# EAGLE design 8x8 LED Anode Driver V3 (EAGLE 6.1)
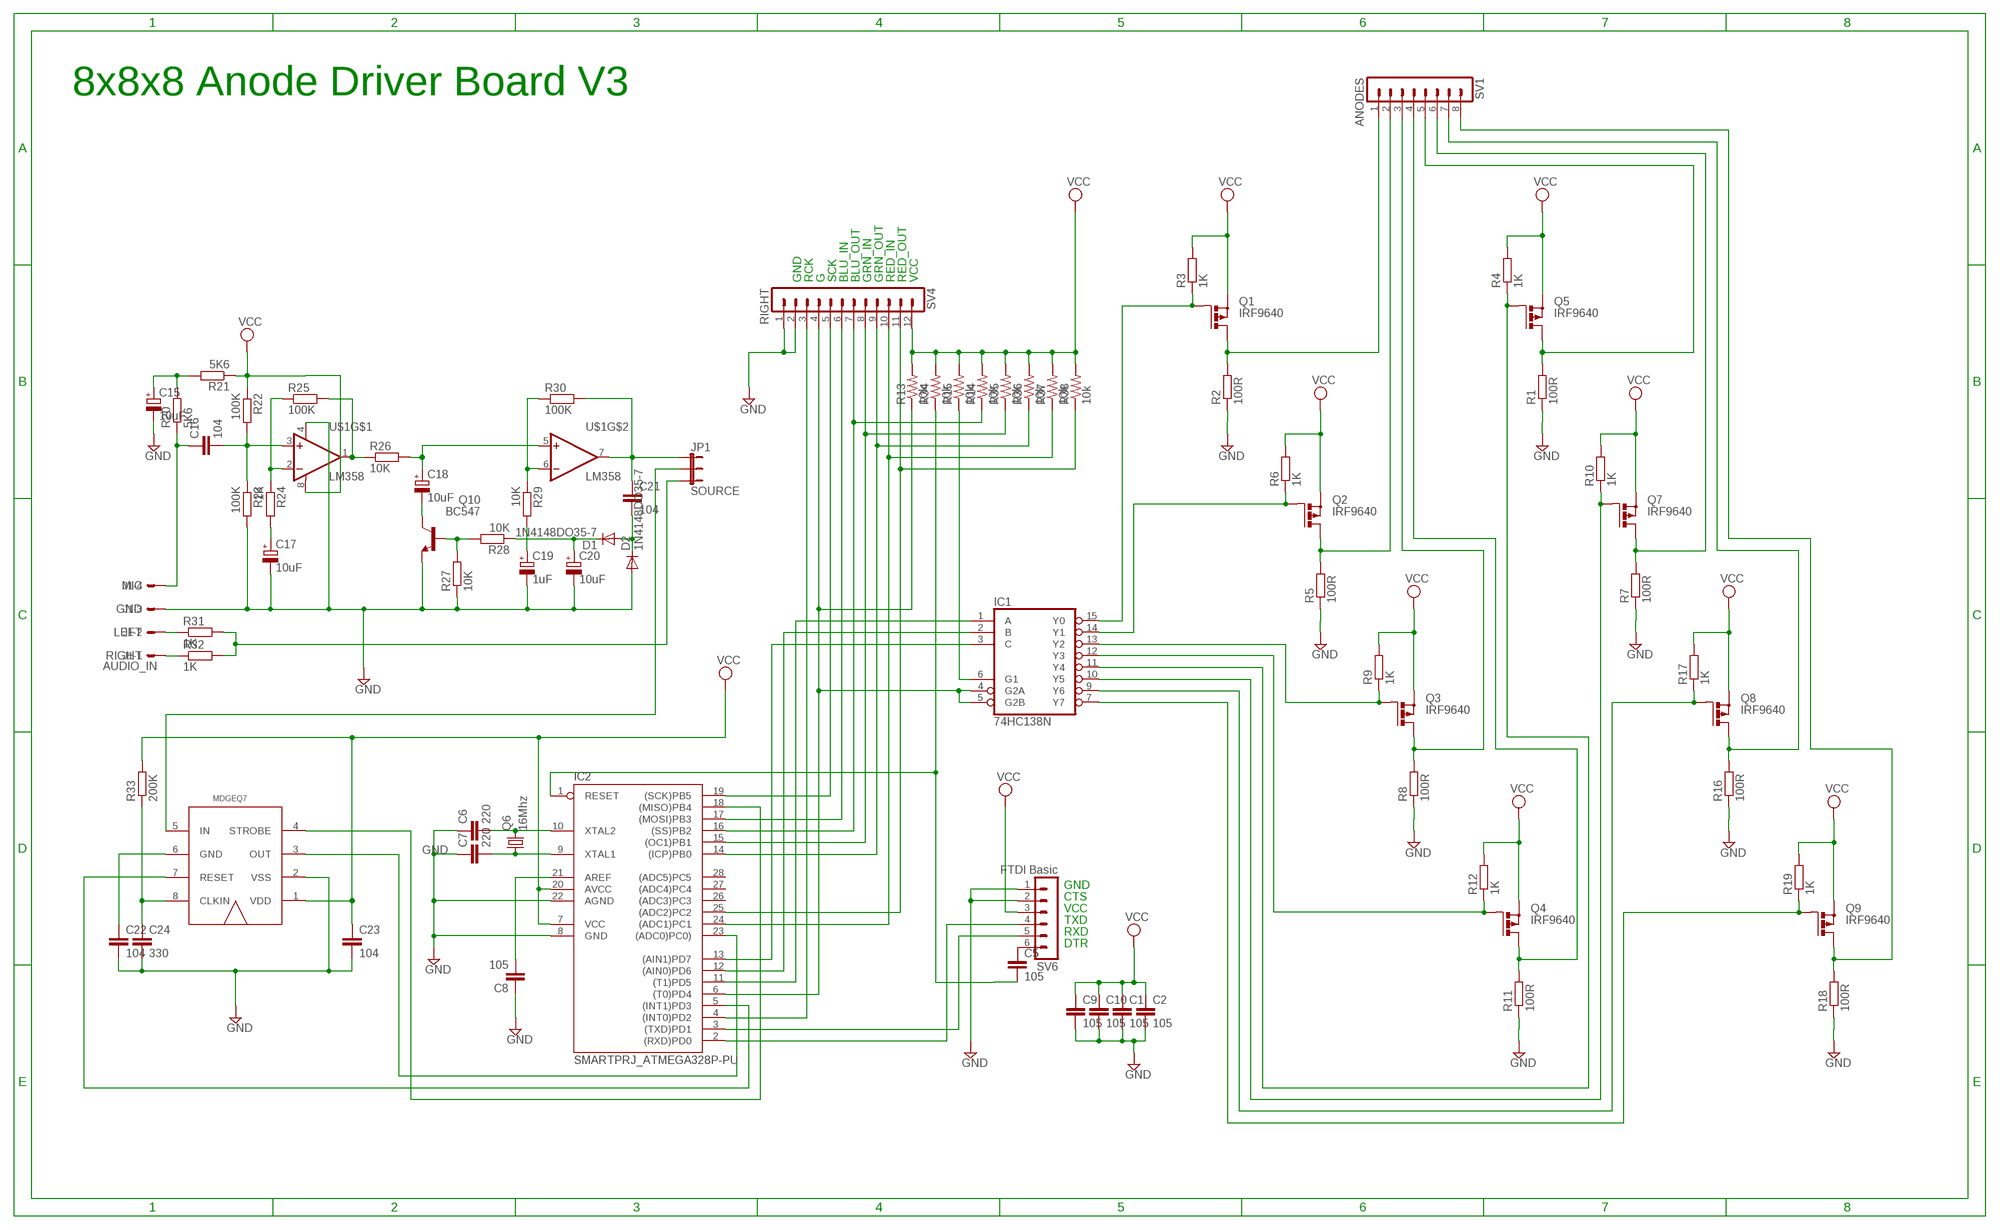
[diagram p0: schematic, sheet 1]

## Parts
C1  105  C-EU025-030X050  [C025-030X050]
C2  105  C-EU025-030X050  [C025-030X050]
C5  105  C-EU050-025X075  [C050-025X075]
C6  220  C-EU050-025X075  [C050-025X075]
C7  220  C-EU050-025X075  [C050-025X075]
C8  105  C-EU025-025X050  [C025-025X050]
C9  105  C-EU025-025X050  [C025-025X050]
C10  105  C-EU025-030X050  [C025-030X050]
C15  10uF  CPOL-EUE2.5-5  [E2,5-5]
C16  104  C-EU050-030X075  [C050-030X075]
C17  10uF  CPOL-EUE2.5-5  [E2,5-5]
C18  10uF  CPOL-EUE2.5-5  [E2,5-5]
C19  1uF  CPOL-EUE2.5-5  [E2,5-5]
C20  10uF  CPOL-EUE2.5-5  [E2,5-5]
C21  104  C-EU050-030X075  [C050-030X075]
C22  104  C-EU025-030X050  [C025-030X050]
C23  104  C-EU025-030X050  [C025-030X050]
C24  330  C-EU050-030X075  [C050-030X075]
D1  1N4148DO35-7  [DO35-7]
D2  1N4148DO35-7  [DO35-7]
IC1  74HC138N  [DIL16]
IC2  SMARTPRJ_ATMEGA328P-PU  [SMARTPRJ_DIL28-3]
J1  AUDIO_IN  22-05-7048-04  [7395-04]
JP1  SOURCE  JUMPER-3PTH  [1X03]
Q1  IRF9640  PMOSFET_PTO220BH_NH  [TO220BH_NO_HOLE]
Q2  IRF9640  PMOSFET_PTO220BH_NH  [TO220BH_NO_HOLE]
Q3  IRF9640  PMOSFET_PTO220BH_NH  [TO220BH_NO_HOLE]
Q4  IRF9640  PMOSFET_PTO220BH_NH  [TO220BH_NO_HOLE]
Q5  IRF9640  PMOSFET_PTO220BH_NH  [TO220BH_NO_HOLE]
Q6  16Mhz  CRYSTALHC49S  [HC49/S]
Q7  IRF9640  PMOSFET_PTO220BH_NH  [TO220BH_NO_HOLE]
Q8  IRF9640  PMOSFET_PTO220BH_NH  [TO220BH_NO_HOLE]
Q9  IRF9640  PMOSFET_PTO220BH_NH  [TO220BH_NO_HOLE]
Q10  BC547  [TO92]
R1  100R  R-EU_0207/10  [0207/10]
R2  100R  R-EU_0207/10  [0207/10]
R3  1K  R-EU_0207/10  [0207/10]
R4  1K  R-EU_0207/10  [0207/10]
R5  100R  R-EU_0207/10  [0207/10]
R6  1K  R-EU_0207/10  [0207/10]
R7  100R  R-EU_0207/10  [0207/10]
R8  100R  R-EU_0207/10  [0207/10]
R9  1K  R-EU_0207/10  [0207/10]
R10  1K  R-EU_0207/10  [0207/10]
R11  100R  R-EU_0207/10  [0207/10]
R12  1K  R-EU_0207/10  [0207/10]
R13  10k  R-US_0207/10  [0207/10]
R14  10k  R-US_0207/10  [0207/10]
R15  10k  R-US_0207/10  [0207/10]
R16  100R  R-EU_0207/10  [0207/10]
R17  1K  R-EU_0207/10  [0207/10]
R18  100R  R-EU_0207/10  [0207/10]
R19  1K  R-EU_0207/10  [0207/10]
R20  5K6  R-EU_0207/10  [0207/10]
R21  5K6  R-EU_0207/10  [0207/10]
R22  100K  R-EU_0207/10  [0207/10]
R23  100K  R-EU_0207/10  [0207/10]
R24  1K  R-EU_0207/10  [0207/10]
R25  100K  R-EU_0207/10  [0207/10]
R26  10K  R-EU_0207/10  [0207/10]
R27  10K  R-EU_0207/10  [0207/10]
R28  10K  R-EU_0207/10  [0207/10]
R29  10K  R-EU_0207/10  [0207/10]
R30  100K  R-EU_0207/10  [0207/10]
R31  1K  R-EU_0207/10  [0207/10]
R32  1K  R-EU_0207/10  [0207/10]
R33  200K  R-EU_0207/10  [0207/10]
R34  10k  R-US_0207/10  [0207/10]
R35  10k  R-US_0207/10  [0207/10]
R36  10k  R-US_0207/10  [0207/10]
R37  10k  R-US_0207/10  [0207/10]
R38  10k  R-US_0207/10  [0207/10]
SV1  ANODES  MA08-1W  [MA08-1W]
SV4  RIGHT  MA12-1W  [MA12-1W]
SV6  FTDI Basic  MA06-1  [MA06-1]
U$1  LM358  [DIP08]
U$2  MSGEQ7  [DIL08]

## Nets
BLANK: IC1.4(G2A) IC1.5(G2B) IC2.6((T0)PD4) R13.1 SV4.4
DRAIN_0: Q1.D R2.2 SV1.1
DRAIN_1: Q2.D R5.2 SV1.2
DRAIN_2: Q3.D R8.2 SV1.3
DRAIN_3: Q4.D R11.2 SV1.4
DRAIN_4: Q5.D R1.2 SV1.5
DRAIN_5: Q7.D R7.2 SV1.6
DRAIN_6: Q8.D R16.2 SV1.7
DRAIN_7: Q9.D R18.2 SV1.8
GND: C1.2 C2.2 C6.1 C7.1 C8.1 C9.2 C10.2 C15.- C17.- C19.- C20.- C22.2 C23.2 C24.2 D2.A IC2.8(GND) IC2.22(AGND) J1.3 Q10.1(E) R1.1 R2.1 R5.1 R7.1 R8.1 R11.1 R16.1 R18.1 R23.2 R27.1 SV4.1 SV4.2 SV6.1 SV6.2 U$1.4(V-) U$2.2(VSS)
LATCH: IC2.4((INT0)PD2) SV4.3
MSGEQ7_OUT: IC2.23((ADC0)PC0)) U$2.3(OUT)
MSGEQ7_RESET: IC2.5((INT1)PD3) U$2.7(RESET)
MSGEQ7_STROBE: IC2.18((MISO)PB4) U$2.4(STROBE)
N$1: IC2.16((SS)PB2) R14.1 SV4.7
N$2: IC1.11(Y4) Q5.G R4.1
N$3: IC1.15(Y0) Q1.G R3.1
N$4: IC1.10(Y5) Q7.G R10.1
N$5: IC1.2(B) IC2.12((AIN0)PD6)
N$6: IC1.14(Y1) Q2.G R6.1
N$7: C15.+ R20.2 R21.2
N$8: IC1.3(C) IC2.13((AIN1)PD7)
N$9: IC1.13(Y2) Q3.G R9.1
N$10: IC1.9(Y6) Q8.G R17.1
N$11: IC1.7(Y7) Q9.G R19.1
N$12: IC1.12(Y3) Q4.G R12.1
N$13: C16.1 J1.4 R20.1
N$14: C16.2 R22.2 R23.1 U$1.3(+IN)
N$15: R24.1 R25.1 U$1.2(-IN)
N$16: C17.+ R24.2
N$17: J1.2 R31.1
N$18: J1.1 R32.1
N$19: JP1.3 R31.2 R32.2
N$20: R25.2 R26.1 U$1.1(OUT)
N$21: C18.+ R26.2 U$1.5(+IN)
N$22: R29.1 R30.1 U$1.6(-IN)
N$23: Q10.2(B) R27.2 R28.2
N$24: C18.- Q10.3(C)
N$25: C19.+ R29.2
N$26: IC2.2((RXD)PD0) SV6.4
N$27: IC2.3((TXD)PD1) SV6.5
N$28: IC2.19((SCK)PB5) SV4.5
N$29: C20.+ D1.C R28.1
N$30: IC2.15((OC1)PB1) R35.1 SV4.8
N$31: C7.2 IC2.9(XTAL1) Q6.1
N$32: C6.2 IC2.10(XTAL2) Q6.2
N$33: C8.2 IC2.21(AREF)
N$34: C5.2 IC2.1(RESET) R34.1
N$35: IC2.17((MOSI)PB3) SV4.6
N$36: C5.1 SV6.6
N$37: IC1.1(A) IC2.11((T1)PD5)
N$38: IC1.6(G1) R15.1
N$39: C21.2 D1.A D2.C
N$40: C21.1 JP1.1 R30.2 U$1.7(OUT)
N$41: JP1.2 U$2.5(IN)
N$42: C22.1 U$2.6(GND)
N$43: C24.1 R33.1 U$2.8(CLKIN)
N$44: IC2.14((ICP)PB0) R36.1 SV4.9
N$45: IC2.24((ADC1)PC1) R37.1 SV4.10
N$46: IC2.25((ADC2)PC2) R38.1 SV4.11
VCC: C1.1 C2.1 C9.1 C10.1 C23.1 IC2.7(VCC) IC2.20(AVCC) Q1.S Q2.S Q3.S Q4.S Q5.S Q7.S Q8.S Q9.S R3.2 R4.2 R6.2 R9.2 R10.2 R12.2 R13.2 R14.2 R15.2 R17.2 R19.2 R21.1 R22.1 R33.2 R34.2 R35.2 R36.2 R37.2 R38.2 SV4.12 SV6.3 U$1.8(V+) U$2.1(VDD)
Unconnected: IC2.26((ADC3)PC3) IC2.27((ADC4)PC4) IC2.28((ADC5)PC5)

## Notes on the sheet
- 8x8x8 Anode Driver Board V3
- GND | RCK | G | SCK | BLU_IN | BLU_OUT | GRN_IN | GRN_OUT | RED_IN | RED_OUT | VCC
- MIC
- GND
- LEFT
- RIGHT
- GND
- CTS
- VCC
- TXD
- RXD
- DTR

## Power pins joined to a net without a drawn wire
GND: IC1.8(GND)
VCC: IC1.16(VCC)

## Library data of the parts
C1 C2 C5-C10 C16 C21-C24 = resistor:C-EU: CAPACITOR, European symbol
C15 C17-C20 = resistor:CPOL-EU: POLARIZED CAPACITOR, European symbol
D1 D2 = diode:1N4148: DIODE high speed (Philips)
IC1 = 74xx-eu:74*138: 3-line to 8-line DECODER/DEMULTIPLEXER
IC2 = arduino_Uno_Rev3-02-TH:SMARTPRJ_ATMEGA328P-: MICROCONTROLLER 4 Kbytes FLASH 128 bytes SRAM 256 bytes EEPROM UART 6-channel 10 bit ADC
J1 = con-molex:22-?-04: CONNECTOR wire to board 2.54 mm (.1 inch) pitch header; OC_FARNELL: unknown; OC_NEWARK: unknown
JP1 = SparkFun-Passives:JUMPER-3
Q1-Q5 Q7-Q9 = transistor-power:PMOSFET_P: Power MOSFET P-Channel
Q6 = crystal:CRYSTAL: CRYSTAL; OC_FARNELL: 1667008; OC_NEWARK: unknown
Q10 = transistor-npn:BC547*: NPN Transistor
R1-R12 R16-R33 = resistor:R-EU_: RESISTOR, European symbol
R13-R15 R34-R38 = resistor:R-US_: RESISTOR, American symbol
SV1 = con-lstb:MA08-1W: PIN HEADER; OC_FARNELL: unknown; OC_NEWARK: unknown
SV4 = con-lstb:MA12-1W: PIN HEADER; OC_FARNELL: unknown; OC_NEWARK: unknown
SV6 = con-lstb:MA06-1: PIN HEADER; OC_FARNELL: unknown; OC_NEWARK: unknown
U$1 = SparkFun-AnalogIC:LM358: Jellybean op-amp
U$2 = 8x8x8_cube:MSGEQ7: Seven Band Graphic Equalizer

## Board
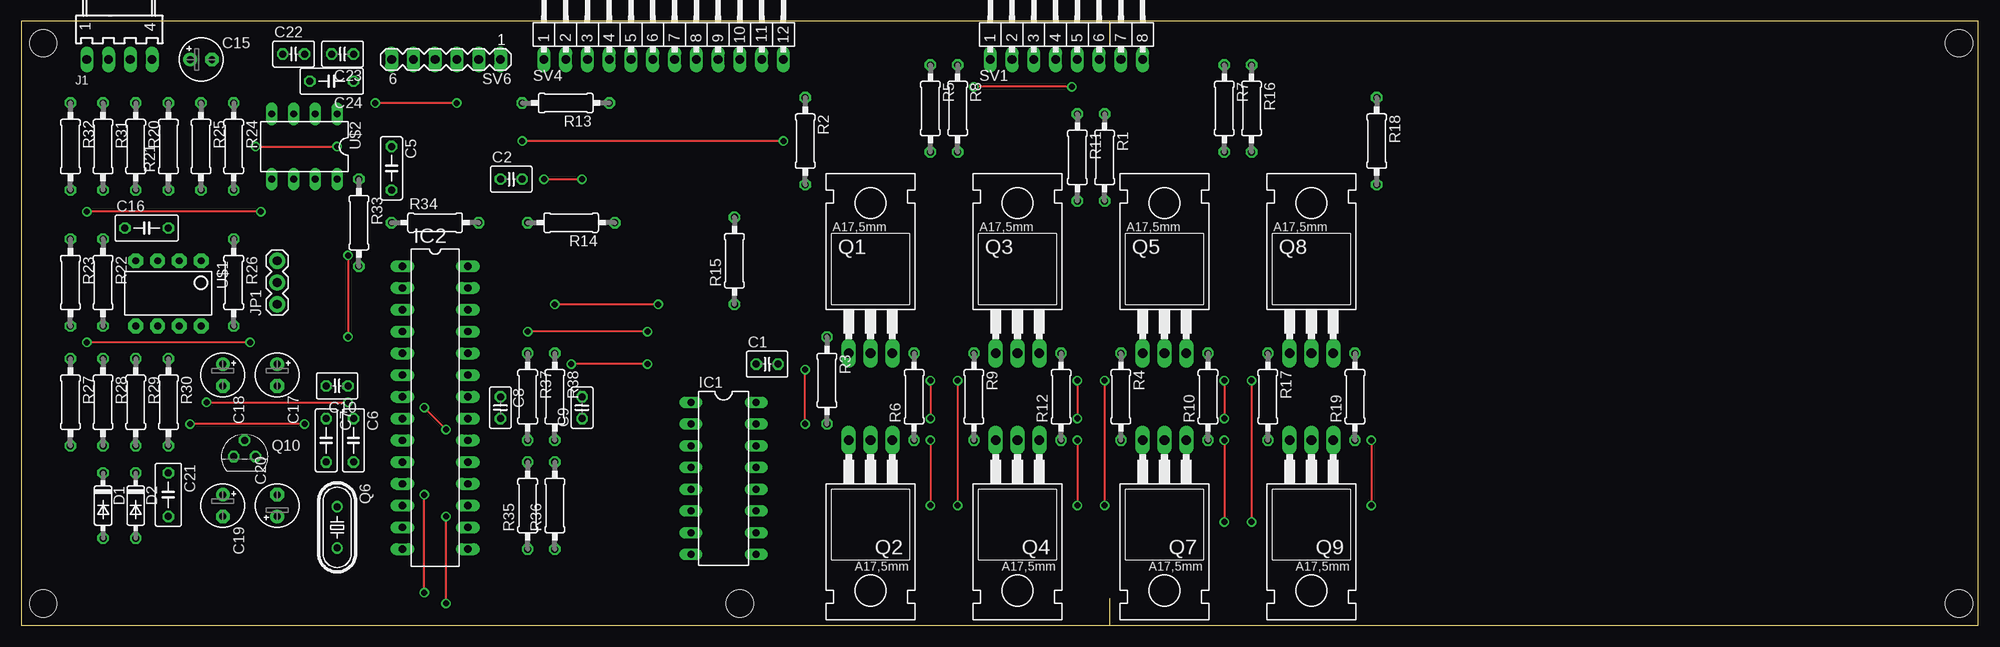
[diagram p1: board, top side]
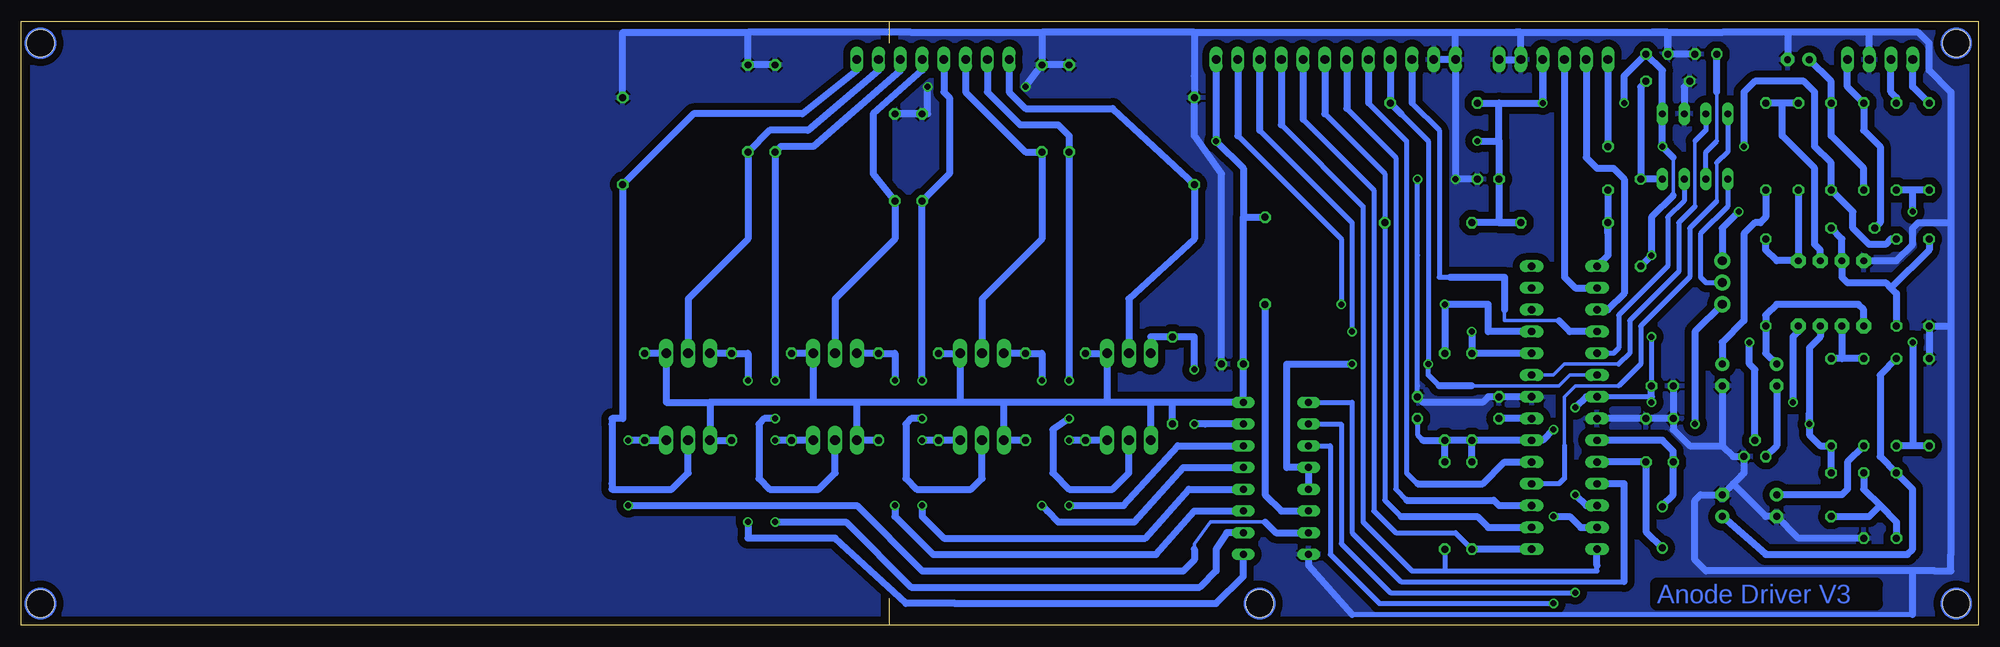
[diagram p2: board, bottom side, seen from below]

Size 228.27 x 70.48 mm. Coordinates in mm from the lower left corner, seen from the top.
Outline: 127,70.48 228.27,70.48 228.27,0.02 0,0.02 0,70.48 127,70.48
Outline: 127,67.94 127,70.48
Outline: 127,0 127,3.17
Copper layers (1*16): Top 0.035mm / dielectric 1.5mm / Bottom 0.035mm
Design rules: minimum track width 10mil, minimum drill 24mil, track to track 8mil, track to pad 8mil, pad to pad 8mil, via to via 8mil, smd to smd 8mil, copper to edge 40mil, drill to drill 8mil, minimum pad ring 10mil, minimum via ring 8mil, stop-mask expansion 4mil, vias tented up to drill 0mil, thermal gap 10mil
Holes 3.2 mm at 2.54,2.54 226.06,2.54 226.06,67.94 2.54,67.94 83.82,2.54

### Footprints (pad centres in the part's own frame; a part is rotated, then mirrored left to right if it is on the bottom)
C025-030X050 = drill 0.813 octagon: 1 -1.27,0; 2 1.27,0
C050-025X075 = drill 0.813 octagon: 1 -2.54,0; 2 2.54,0
C025-025X050 = drill 0.813 octagon: 1 -1.27,0; 2 1.27,0
E2,5-5 = drill 0.813 pad 1.6: + -1.27,0 | drill 0.813 pad 1.6 octagon: - 1.27,0
C050-030X075 = drill 0.813 octagon: 1 -2.54,0; 2 2.54,0
DO35-7 = drill 0.813 octagon: A 3.81,0; C -3.81,0
DIL16 = drill 0.813 long: 1 -8.89,-3.81; 2 -6.35,-3.81; 3 -3.81,-3.81; 4 -1.27,-3.81; 5 1.27,-3.81; 6 3.81,-3.81; 7 6.35,-3.81; 8 8.89,-3.81; 9 8.89,3.81; 10 6.35,3.81; 11 3.81,3.81; 12 1.27,3.81; 13 -1.27,3.81; 14 -3.81,3.81; 15 -6.35,3.81; 16 -8.89,3.81
SMARTPRJ_DIL28-3 = drill 0.85 pad 1.422 long: 1 -16.51,-3.81; 2 -13.97,-3.81; 3 -11.43,-3.81; 4 -8.89,-3.81; 5 -6.35,-3.81; 6 -3.81,-3.81; 7 -1.27,-3.81; 8 1.27,-3.81; 9 3.81,-3.81; 10 6.35,-3.81; 11 8.89,-3.81; 12 11.43,-3.81; 13 13.97,-3.81; 14 16.51,-3.81; 15 16.51,3.81; 16 13.97,3.81; 17 11.43,3.81; 18 8.89,3.81; 19 6.35,3.81; 20 3.81,3.81; 21 1.27,3.81; 22 -1.27,3.81; 23 -3.81,3.81; 24 -6.35,3.81; 25 -8.89,3.81; 26 -11.43,3.81; 27 -13.97,3.81; 28 -16.51,3.81
7395-04 = drill 1.016 long: 1 3.81,0; 2 1.27,0; 3 -1.27,0; 4 -3.81,0
1X03 = drill 1.016 pad 1.88: 1 0,0; 2 2.54,0; 3 5.08,0
TO220BH_NO_HOLE = drill 1.118 long: D 0,-6.35; G -2.54,-6.35; S 2.54,-6.35
HC49/S = drill 0.813: 1 -2.413,0; 2 2.413,0
TO92 = drill 0.813 octagon: 1 1.27,0; 2 0,1.905; 3 -1.27,0
0207/10 = drill 0.813 octagon: 1 -5.08,0; 2 5.08,0
MA08-1W = drill 1.016 long: 1 -8.89,0; 2 -6.35,0; 3 -3.81,0; 4 -1.27,0; 5 1.27,0; 6 3.81,0; 7 6.35,0; 8 8.89,0
MA12-1W = drill 1.016 long: 1 -13.97,0; 2 -11.43,0; 3 -8.89,0; 4 -6.35,0; 5 -3.81,0; 6 -1.27,0; 7 1.27,0; 8 3.81,0; 9 6.35,0; 10 8.89,0; 11 11.43,0; 12 13.97,0
MA06-1 = drill 1.016 long: 1 -6.35,0; 2 -3.81,0; 3 -1.27,0; 4 1.27,0; 5 3.81,0; 6 6.35,0
DIP08 = drill 0.813 pad 1.727 octagon: 1 -3.81,-3.81; 2 -1.27,-3.81; 3 1.27,-3.81; 4 3.81,-3.81; 5 3.81,3.81; 6 1.27,3.81; 7 -1.27,3.81; 8 -3.81,3.81
DIL08 = drill 0.813 long: 1 -3.81,-3.81; 2 -1.27,-3.81; 3 1.27,-3.81; 4 3.81,-3.81; 5 3.81,3.81; 6 1.27,3.81; 7 -1.27,3.81; 8 -3.81,3.81

### Placement (x,y rotation side)
C1  87,30.48 0 top
C2  57.15,52.07 0 top
C5  43.18,53.34 270 top
C6  38.73,21.59 270 top
C7  35.56,21.59 270 top
C8  55.88,25.4 270 top
C9  65.41,25.4 90 top
C10  36.83,27.94 180 top
C15  20.95,66.04 0 top
C16  14.61,46.35 0 top
C17  29.84,29.21 270 top
C18  23.5,29.21 270 top
C19  23.5,13.97 270 top
C20  29.84,13.97 90 top
C21  17.14,15.24 270 top
C22  31.75,66.67 0 top
C23  37.47,66.67 180 top
C24  36.2,63.5 180 top
D1  9.53,13.97 270 top
D2  13.34,13.97 270 top
IC1  81.92,17.14 270 top
IC2  48.26,25.4 270 top
J1  11.43,66.04 180 top
JP1  29.84,37.47 90 top
Q1  99.06,38.1 0 top
Q2  99.06,15.24 180 top
Q3  116.2,38.1 0 top
Q4  116.2,15.24 180 top
Q5  133.35,38.1 0 top
Q6  36.83,11.43 270 top
Q7  133.35,15.24 180 top
Q8  150.5,38.1 0 top
Q9  150.5,15.24 180 top
Q10  26.04,19.68 0 top
R1  126.36,54.61 270 top
R2  91.44,56.52 270 top
R3  93.98,28.57 270 top
R4  128.27,26.67 270 top
R5  106.05,60.33 270 top
R6  104.14,26.67 90 top
R7  140.34,60.33 270 top
R8  109.22,60.33 270 top
R9  111.12,26.67 270 top
R10  138.43,26.67 90 top
R11  123.19,54.61 270 top
R12  121.28,26.67 90 top
R13  63.5,60.96 180 top
R14  64.14,46.99 180 top
R15  83.19,42.55 90 top
R16  143.51,60.33 270 top
R17  145.41,26.67 270 top
R18  158.12,56.52 270 top
R19  155.57,26.67 90 top
R20  13.34,55.88 270 top
R21  17.14,55.88 90 top
R22  9.53,40.01 270 top
R23  5.71,40.01 270 top
R24  24.77,55.88 270 top
R25  20.95,55.88 270 top
R26  24.77,40.01 270 top
R27  5.71,26.04 270 top
R28  9.53,26.04 270 top
R29  13.34,26.04 270 top
R30  17.14,26.04 270 top
R31  9.53,55.88 270 top
R32  5.71,55.88 270 top
R33  39.37,46.99 270 top
R34  48.26,46.99 0 top
R35  59.05,13.97 90 top
R36  62.23,13.97 90 top
R37  59.05,26.67 270 top
R38  62.23,26.67 270 top
SV1  121.92,66.04 0 top
SV4  74.93,66.04 0 top
SV6  49.53,66.04 180 top
U$1  17.14,38.73 180 top
U$2  33.02,55.88 180 top

### Tracks (layer width: path | path; a pad name or v marks a point on that pad's centre or on a via)
BLANK  (via drill 0.7 pad 1.02)
  Top 0.254: v73.03,30.48 v64.14,30.48
  Bottom 0.406: IC2.6 47.62,29.21 48.9,27.94 59.05,27.94
  Bottom 0.61: 62.87,27.94 64.14,29.21 v64.14,30.48 64.14,56.52 67.31,59.69
  Bottom 0.813: 59.05,27.94 61.59,27.94 62.87,27.94 | v73.03,30.48 80.64,30.48 80.64,19.05 80.64,18.41 IC1.4 IC1.5 | SV4.4 R13.1 67.31,59.69
DRAIN_0
  Bottom 0.813: Q1.D 99.06,38.1 91.44,45.09 R2.2 100.97,60.33 111.12,60.33 113.03,62.23 SV1.1
DRAIN_1  (via drill 0.7 pad 1.02)
  Top 0.254: v106.05,28.57 v106.05,24.13
  Bottom 0.813: v106.05,28.57 106.05,31.11 106.05,33.66 R5.2 106.05,57.15 107.31,58.42 111.76,58.42 115.57,62.23 SV1.2 | Q2.D 99.06,17.78 100.97,15.88 106.05,15.88 107.95,17.78 107.95,22.86 v106.05,24.13
DRAIN_2
  Bottom 0.813: Q3.D 116.2,38.1 109.22,45.09 R8.2 111.12,55.24 118.11,62.23 SV1.3
DRAIN_3  (via drill 0.7 pad 1.02)
  Top 0.254: v123.19,28.57 v123.19,24.13
  Bottom 0.813: SV1.4 120.65,62.23 120.02,61.59 120.02,52.7 R11.2 v123.19,28.57 | v123.19,24.13 124.46,24.13 125.09,23.5 125.09,17.14 123.83,15.88 117.47,15.88 116.2,17.14 Q4.D
DRAIN_4
  Bottom 0.813: Q5.D 133.35,38.1 126.36,45.09 R1.2 128.91,52.7 128.91,59.69 123.19,64.77 SV1.5
DRAIN_5  (via drill 0.7 pad 1.02)
  Top 0.254: v140.34,28.57 v140.34,24.13
  Bottom 0.813: Q7.D 133.35,17.78 135.25,15.88 140.97,15.88 142.24,17.14 142.24,23.5 141.6,24.13 v140.34,24.13 | SV1.6 125.73,64.77 135.89,55.88 139.7,55.88 R7.2 140.34,33.66 v140.34,28.57
DRAIN_6
  Bottom 0.813: Q8.D 150.5,38.1 143.51,45.09 R16.2 140.97,57.78 136.53,57.78 128.27,64.77 SV1.7
DRAIN_7
  Bottom 0.813: SV1.8 130.81,64.77 137.16,59.69 149.86,59.69 R18.2 158.12,24.13 159.38,24.13 159.38,23.5 159.38,16.51 159.38,15.88 152.4,15.88 150.5,17.78 Q9.D
GND  (via drill 0.7 pad 1.02)
  Top 0.254: v60.96,52.07 v65.41,52.07 | v122.56,62.87 v111.12,62.87
  Bottom 0.61: 64.77,26.04 C9.2 65.41,27.94 65.41,43.18 v65.41,52.07 | 73.03,1.27 7.62,1.27
  Bottom 0.813: R27.1 R23.2 3.17,34.92 | D2.A 20.95,10.16 C19.- 24.77,12.7 28.57,16.51 | C17.- 29.84,20.95 | 29.84,20.95 28.57,19.68 Q10.1 27.3,17.78 | 27.3,17.78 27.62,17.46 | 27.62,17.46 28.57,16.51 | 28.57,16.51 C20.- 32.38,15.24 33.02,14.61 33.02,7.62 31.75,6.35 7.62,6.35 | 27.3,17.78 27.62,17.46 | 3.17,34.92 3.17,8.26 3.17,6.35 5.08,6.35 7.62,6.35 | 12.7,69.22 J1.3 12.7,69.22 | 12.7,69.22 22.23,69.22 | 22.23,69.22 C15.- | 3.17,46.99 3.17,62.23 5.71,64.77 5.71,67.94 6.99,69.22 12.7,69.22 | 3.17,46.99 3.17,34.92 | 22.23,69.22 29.84,69.22 36.2,69.22 | C23.2 36.2,69.22 | 36.2,69.22 38.1,69.22 36.2,69.22 | C7.1 C6.1 | C7.1 IC2.8 | C7.1 C10.2 C7.1 | SV6.1 SV6.2 53.34,69.22 | SV4.1 SV4.2 | IC2.22 C8.1 57.15,26.67 57.78,26.04 64.77,26.04 | 53.34,69.22 53.98,69.22 53.34,69.22 | 53.34,69.22 39.37,69.22 36.2,69.22 | 36.2,69.22 C23.2 | R11.1 R1.1 R11.1 | R18.1 158.12,69.22 143.51,69.22 | 91.44,69.22 60.96,69.22 | 60.96,69.22 53.34,69.22 | R7.1 R16.1 143.51,69.22 | R5.1 R8.1 | SV4.1 60.96,69.22 | SV4.1 60.96,62.87 60.96,59.69 v60.96,52.07 C2.2 | IC1.8 78.11,6.99 73.03,1.27 | C1.2 88.27,52.7 91.44,57.15 R2.1 91.44,64.14 91.44,69.22 | C7.1 35.56,22.86 33.66,20.95 29.84,20.95 | 109.22,69.22 124.46,69.22 143.51,69.22 | 109.22,69.22 R8.1 | C24.2 34.29,62.87 U$2.2 | C22.2 C23.2 | 91.44,69.22 109.22,69.22 | R11.1 122.56,59.69 v122.56,62.87 | v111.12,62.87 R8.1 | 7.62,1.27 7.62,6.35 | U$1.4 9.53,42.55 7.62,44.45 7.62,46.35 6.99,46.99 3.17,46.99
  pour Bottom (isolate 0.813): 0,70.48 0,0 126.36,0 126.36,70.48
  pour Bottom (isolate 0.813): 127.64,0 228.6,0 228.6,70.48 127.64,70.48
LATCH
  Bottom 0.406: 48.9,35.56 55.24,35.56 55.24,36.83
  Bottom 0.61: 66.04,60.96 62.87,57.78 62.87,40.64 61.59,40.64
  Bottom 0.813: IC2.4 47.62,34.29 48.9,35.56 | SV4.3 66.04,60.96 | 61.59,40.64 55.24,40.64 55.24,36.83
MSGEQ7_OUT
  Bottom 0.406: 33.02,56.52 33.02,48.9 | 41.91,30.48 48.26,30.48 49.53,29.21 IC2.23
  Bottom 0.61: U$2.3 31.75,57.78 33.02,56.52 | 41.91,30.48 40.64,31.75 40.64,35.56 34.92,41.27 34.92,46.99 33.02,48.9
MSGEQ7_RESET
  Bottom 0.61: U$2.7 34.29,49.53 36.2,47.62 36.2,41.91 41.91,36.2 41.91,32.38 42.55,31.75 IC2.5
MSGEQ7_STROBE
  Bottom 0.406: 30.48,53.98 30.48,49.53 | 41.91,27.94 46.99,27.94 48.26,26.67 48.26,20.95
  Bottom 0.61: U$2.4 29.21,55.24 30.48,53.98 | 41.91,27.94 39.37,30.48 39.37,34.92 33.66,40.64 33.66,46.35 30.48,49.53 | 48.26,20.95 48.26,17.14 48.9,16.51 IC2.18
N$1
  Bottom 0.61: 76.2,59.69 69.22,52.7 R14.1 69.22,14.61 67.31,12.7
  Bottom 0.813: SV4.7 76.2,59.69 | 67.31,12.7 58.42,12.7 57.15,11.43 IC2.16
N$2  (via drill 0.7 pad 1.02)
  Top 0.254: v126.36,28.57 v126.36,13.97
  Bottom 0.813: Q5.G R4.1 126.36,31.75 v126.36,28.57 | v126.36,13.97 126.36,12.7 121.92,8.26 95.89,8.26 91.44,13.34 IC1.11
N$3  (via drill 0.7 pad 1.02)
  Top 0.254: v91.44,23.5 v91.44,29.84
  Bottom 0.813: Q1.G 96.52,32.38 96.52,33.66 R3.1 91.44,33.66 v91.44,29.84 | IC1.15 90.17,23.5 v91.44,23.5
N$4  (via drill 0.7 pad 1.02)
  Top 0.254: v140.34,21.59 v140.34,12.06
  Bottom 0.813: R10.1 Q7.G v140.34,21.59 | v140.34,12.06 132.08,12.06 124.46,4.45 90.81,4.45 88.9,6.35 88.9,8.89 87.63,10.79 IC1.10
N$5  (via drill 0.7 pad 1.02)
  Top 0.254: v46.99,3.81 v46.99,15.24
  Bottom 0.61: IC1.2 74.3,23.5 74.3,9.53 68.58,3.81 v46.99,3.81
  Bottom 0.813: v46.99,15.24 45.72,13.97 IC2.12
N$6  (via drill 0.7 pad 1.02)
  Top 0.254: v106.05,21.59 v106.05,13.97
  Bottom 0.813: R6.1 Q2.G v106.05,21.59 | v106.05,13.97 99.69,13.97 93.34,20.95 IC1.14
N$7
  Bottom 0.813: R20.2 13.34,53.34 17.14,57.15 R21.2 17.14,63.5 C15.+
N$8  (via drill 0.7 pad 1.02)
  Top 0.254: v49.53,2.54 v49.53,12.7
  Bottom 0.61: IC1.3 75.56,20.95 75.56,8.26 69.85,2.54 v49.53,2.54
  Bottom 0.813: v49.53,12.7 47.62,12.7 46.35,11.43 IC2.13
N$9  (via drill 0.7 pad 1.02)
  Top 0.254: v109.22,28.57 v109.22,13.97
  Bottom 0.813: Q3.G R9.1 109.22,31.75 v109.22,28.57 | v109.22,13.97 108.58,13.34 107.31,12.06 98.42,12.06 92.71,18.41 IC1.13
N$10  (via drill 0.7 pad 1.02)
  Top 0.254: v143.51,28.57 v143.51,12.06
  Bottom 0.813: R17.1 Q8.G R17.1 | R17.1 143.51,31.75 v143.51,28.57 | v143.51,12.06 143.51,10.16 133.35,10.16 125.09,2.54 119.38,2.54 88.9,2.54 85.72,5.71 IC1.9
N$11  (via drill 0.7 pad 1.02)
  Top 0.254: v157.48,21.59 v157.48,13.97
  Bottom 0.406: 83.19,12.06 89.53,12.06 91.44,9.53 91.44,8.89
  Bottom 0.813: R19.1 Q9.G v157.48,21.59 | v157.48,13.97 130.81,13.97 | 130.81,13.97 123.19,6.35 | 123.19,6.35 92.71,6.35 91.44,7.62 91.44,8.89 | 83.19,12.06 81.92,10.79 IC1.7 | 130.81,13.97 123.19,6.35
N$12  (via drill 0.7 pad 1.02)
  Top 0.254: v123.19,21.59 v123.19,13.97
  Bottom 0.813: R12.1 Q4.G v123.19,21.59 | v123.19,13.97 123.19,12.7 120.65,10.16 97.16,10.16 92.08,15.88 IC1.12
N$13
  Bottom 0.813: C16.1 11.43,46.99 11.43,55.88 13.34,57.78 R20.1 15.24,62.87 J1.4
N$14
  Bottom 0.813: C16.2 15.88,45.09 U$1.3 15.88,40.64 15.24,40.01 10.79,40.01 10.16,39.37 | 10.16,39.37 9.53,38.73 R22.2 | R23.1 5.71,43.81 10.16,39.37
N$15
  Bottom 0.813: R25.1 22.86,60.96 | 22.86,60.96 R24.1 | U$1.2 18.41,43.81 19.05,44.45 19.05,53.34 22.86,57.15 22.86,60.96
N$16
  Bottom 0.813: C17.+ 29.84,33.02 27.3,35.56 27.3,45.72 26.04,46.99 25.4,46.99 24.77,47.62 R24.2
N$17
  Bottom 0.813: R31.1 9.53,61.59 10.16,62.23 J1.2
N$18
  Bottom 0.813: R32.1 7.62,62.87 J1.1
N$19  (via drill 0.7 pad 1.02)
  Top 0.254: v27.94,48.26 v7.62,48.26
  Bottom 0.813: R32.2 7.62,50.8 | 7.62,50.8 R31.2 | v7.62,48.26 7.62,50.8 | v27.94,48.26 29.84,46.35 JP1.3
N$20
  Bottom 0.813: R25.2 U$1.1 23.5,42.55 24.77,43.81 R26.1
N$21
  Bottom 0.813: U$1.5 13.34,36.83 13.97,37.47 22.86,37.47 23.5,37.47 24.77,36.2 R26.2 24.77,31.75 C18.+
N$22
  Bottom 0.813: R29.1 15.88,31.11 | 15.88,31.11 R30.1 | U$1.6 15.88,31.11
N$23  (via drill 0.7 pad 1.02)
  Top 0.254: v26.67,33.02 v7.62,33.02
  Bottom 0.813: R27.2 7.62,20.95 | 7.62,20.95 R28.2 | Q10.2 26.04,29.84 26.67,30.48 v26.67,33.02 | v7.62,33.02 7.62,20.95
N$24
  Bottom 0.813: C18.- 23.5,20.95 Q10.3
N$25
  Bottom 0.813: R29.2 15.24,19.05 15.24,15.88 15.88,15.24 C19.+
N$26
  Bottom 0.813: SV6.4 48.26,40.64 46.99,39.37 IC2.2
N$27
  Bottom 0.813: SV6.5 45.72,54.61 44.45,53.34 42.55,53.34 41.27,52.07 41.27,38.73 43.18,36.83 IC2.3
N$28
  Bottom 0.61: 71.12,60.96 66.67,56.52 66.67,17.78 65.41,16.51
  Bottom 0.813: SV4.5 71.12,60.96 | 65.41,16.51 57.78,16.51 55.24,19.05 IC2.19
N$29
  Bottom 0.813: R28.1 11.43,29.21 11.43,19.68 D1.C 7.62,15.88 7.62,8.89 8.26,8.26 24.77,8.26 C20.+
N$30
  Bottom 0.61: 78.74,59.05 70.48,50.8 70.48,13.34 67.94,10.79 60.96,10.79 R35.1
  Bottom 0.813: SV4.8 78.74,59.05 | IC2.15 R35.1
N$31
  Bottom 0.813: Q6.1 36.83,13.97 35.56,15.24 C7.2 35.56,20.32 36.83,21.59 IC2.9
N$32
  Bottom 0.813: Q6.2 38.73,10.92 C6.2 IC2.10
N$33
  Bottom 0.813: IC2.21 C8.2
N$34
  Bottom 0.813: C5.2 R34.1 | R34.1 43.18,45.72 | 43.18,45.72 43.18,43.18 IC2.1 | 43.18,45.72 R34.1
N$35
  Bottom 0.61: 73.66,60.33 67.94,54.61 67.94,15.88 66.67,14.61
  Bottom 0.813: SV4.6 73.66,60.33 | 66.67,14.61 56.52,14.61 55.88,13.97 IC2.17
N$36
  Bottom 0.813: SV6.6 C5.1
N$37
  Bottom 0.61: IC1.1 73.03,26.04 73.03,10.79 67.31,5.08 41.27,5.08
  Bottom 0.813: 41.27,5.08 41.27,16.51 IC2.11
N$38
  Bottom 0.813: R15.1 83.19,15.24 81.28,13.34 IC1.6
N$39
  Bottom 0.813: D2.C 13.34,15.88 11.43,13.97 | 11.43,13.97 9.53,12.06 D1.A | C21.2 12.7,12.7 11.43,13.97
N$40  (via drill 0.7 pad 1.02)
  Top 0.254: v33.02,23.5 v19.68,23.5
  Bottom 0.813: U$1.7 18.41,33.66 19.68,32.38 19.68,24.77 | 19.68,24.77 v19.68,23.5 | v19.68,23.5 19.68,22.23 18.41,20.95 R30.2 C21.1 | JP1.1 33.02,34.29 v33.02,23.5 | v19.68,23.5 19.68,24.77
N$41
  Bottom 0.61: JP1.2 31.75,40.01 32.38,40.64 32.38,45.72 29.21,48.9 U$2.5
N$42
  Bottom 0.406: 30.48,56.52 30.48,62.23
  Bottom 0.61: U$2.6 31.75,55.24 30.48,56.52
  Bottom 0.813: 30.48,62.23 C22.1
N$43
  Bottom 0.813: U$2.8 R33.1 39.37,62.87 C24.1
N$44
  Bottom 0.61: 62.23,6.35 66.04,6.35 71.75,12.06 71.75,48.9 81.28,58.42 | 62.23,6.35 48.26,6.35 44.45,6.35 44.45,6.99 | R36.1 62.23,6.35
  Bottom 0.813: SV4.9 81.28,58.42 | 44.45,6.99 IC2.14
N$45  (via drill 0.7 pad 1.02)
  Top 0.254: v73.03,34.29 v59.05,34.29
  Bottom 0.61: 83.82,57.78 73.03,46.99 v73.03,34.29
  Bottom 0.813: IC2.24 R37.1 v59.05,34.29 | SV4.10 83.82,57.78
N$46  (via drill 0.7 pad 1.02)
  Top 0.254: v74.3,37.47 v62.23,37.47
  Bottom 0.61: 86.36,57.15 74.3,45.09 v74.3,37.47
  Bottom 0.813: SV4.11 86.36,57.15 | R38.1 v62.23,37.47 57.15,37.47 57.15,34.29 IC2.25
VCC  (via drill 0.7 pad 1.02)
  Top 0.254: v27.3,55.88 v36.83,55.88 | v38.1,43.18 v38.1,33.66 | v88.9,56.52 v58.42,56.52 | v46.99,25.4 v49.53,22.86 | v50.8,60.96 v41.27,60.96 | v21.59,26.04 v38.1,26.04
  Bottom 0.406: 35.56,54.61 35.56,50.16
  Bottom 0.61: C9.1 65.41,22.23 64.77,21.59 | IC2.7 38.1,26.67 C10.1 v38.1,33.66
  Bottom 0.813: R37.2 IC2.20 50.8,21.59 v49.53,22.86 | R37.2 R38.2 | 64.77,21.59 R38.2 | 93.98,26.04 92.08,26.04 90.81,26.04 IC1.16 C1.1 85.72,47.62 | 93.98,26.04 96.52,26.04 | 96.52,26.04 101.6,26.04 | 101.6,26.04 113.67,26.04 | 113.67,26.04 118.75,26.04 | 118.75,26.04 130.81,26.04 | 130.81,26.04 135.89,26.04 | 101.6,26.04 Q1.S R6.2 | Q2.S 96.52,26.04 | R9.2 Q4.S 113.67,26.04 | R12.2 Q3.S 118.75,26.04 | R4.2 Q7.S 130.81,26.04 | R10.2 Q5.S 135.89,26.04 | R17.2 Q9.S 147.96,26.04 | 135.89,26.04 147.96,26.04 | 147.96,26.04 153.03,26.04 Q8.S R19.2 | 55.88,56.52 C2.1 55.88,46.99 | 55.88,46.99 R34.2 | R34.2 55.88,46.99 | 55.88,46.99 R14.2 | R13.2 55.88,60.96 | SV4.12 v88.9,56.52 85.72,53.34 85.72,47.62 | v58.42,56.52 55.88,56.52 | IC2.7 45.72,26.67 v46.99,25.4 | 55.88,46.99 R34.2 | R33.2 v38.1,43.18 38.1,47.62 35.56,50.16 | 85.72,47.62 R15.2 | 55.88,56.52 55.88,60.96 | v27.3,55.88 27.3,62.23 26.04,63.5 20.32,63.5 19.05,62.23 19.05,55.88 17.14,53.98 R21.1 14.61,48.26 14.61,46.35 12.7,44.45 10.79,44.45 10.16,45.09 R22.1 | 35.56,54.61 v36.83,55.88 U$2.1 36.83,64.77 C23.1 41.27,64.14 v41.27,60.96 | R3.2 93.98,26.04 | R35.2 R37.2 | R36.2 R38.2 | 55.88,60.96 v50.8,60.96 | v50.8,60.96 SV6.3 v50.8,60.96 | U$1.8 20.95,34.29 21.59,33.66 v21.59,26.04 | v38.1,26.04 38.1,26.67 C10.1
(copper drawn outside any net)
  shapes: Bottom circle x5

### Text on the board
Bottom: Anode Driver V3